# EAGLE schematic Schematic (EAGLE 9.7.0)
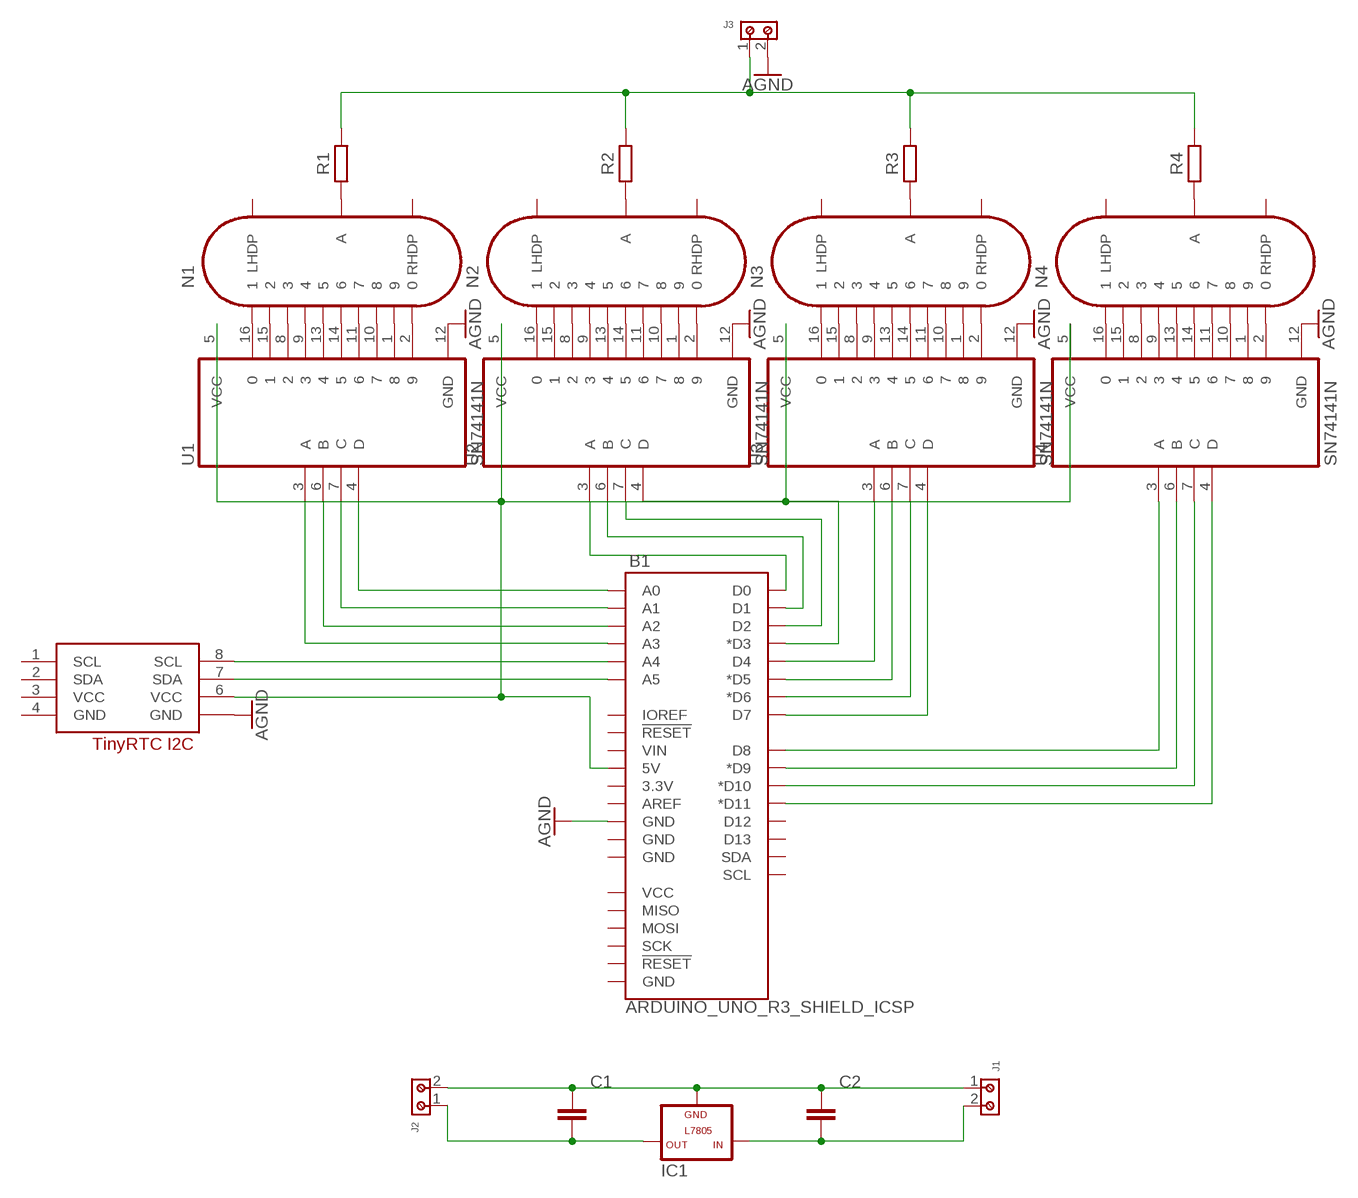
[diagram p0: schematic, sheet 1]

## Parts
B1  ARDUINO_UNO_R3_SHIELD_ICSP  [UNO_R3_SHIELD_ICSP]
C1  C_RADIAL-12.5MM-DIA  [CAPRD550W60D1025H1250B]
C2  C_RADIAL-12.5MM-DIA  [CAPRD550W60D1025H1250B]
IC1  L7805  [78XXL]
J1  691213710002  [691213710002]
J2  691213710002  [691213710002]
J3  691213710002  [691213710002]
N1  IN-14  [IN-14]
N2  IN-14  [IN-14]
N3  IN-14  [IN-14]
N4  IN-14  [IN-14]
R1  R_AXIAL-11.7MM-PITCH  [RESAD1176W63L850D250B]
R2  R_AXIAL-11.7MM-PITCH  [RESAD1176W63L850D250B]
R3  R_AXIAL-11.7MM-PITCH  [RESAD1176W63L850D250B]
R4  R_AXIAL-11.7MM-PITCH  [RESAD1176W63L850D250B]
T1  TINYRTC  [TINYRTC]
U1  SN74141N  [DIP762W46P254L2134H508Q16]
U2  SN74141N  [DIP762W46P254L2134H508Q16]
U3  SN74141N  [DIP762W46P254L2134H508Q16]
U4  SN74141N  [DIP762W46P254L2134H508Q16]

## Nets
AGND: B1.GND@2(GND) J3.2 T1.5(GND) U1.12(GND) U2.12(GND) U3.12(GND) U4.12(GND)
N$1: N1.1 U1.16
N$2: N1.2 U1.15
N$3: N1.3 U1.8
N$4: N1.4 U1.9
N$5: N1.5 U1.13
N$6: N1.6 U1.14
N$7: N1.7 U1.11
N$8: N1.8 U1.10
N$9: N1.9 U1.1
N$10: N1.0 U1.2
N$11: N2.1 U2.16
N$12: N2.2 U2.15
N$13: N2.3 U2.8
N$14: N2.4 U2.9
N$15: N2.5 U2.13
N$16: N2.6 U2.14
N$17: N2.7 U2.11
N$18: N2.8 U2.10
N$19: N2.9 U2.1
N$20: N2.0 U2.2
N$21: N3.1 U3.16
N$22: N3.2 U3.15
N$23: N3.3 U3.8
N$24: N3.4 U3.9
N$25: N3.5 U3.13
N$26: N3.6 U3.14
N$27: N3.7 U3.11
N$28: N3.8 U3.10
N$29: N3.9 U3.1
N$30: N3.0 U3.2
N$31: N4.1 U4.16
N$32: N4.2 U4.15
N$33: N4.3 U4.8
N$34: N4.4 U4.9
N$35: N4.5 U4.13
N$36: N4.6 U4.14
N$37: N4.7 U4.11
N$38: N4.8 U4.10
N$39: N4.9 U4.1
N$40: N4.0 U4.2
N$41: C1.1 C2.1 IC1.GND J1.1 J2.2
N$42: C2.2 IC1.IN J1.2
N$43: C1.2 IC1.OUT J2.1
N$44: B1.A5 T1.7(SDA)
N$45: B1.A4 T1.8(SCL)
N$46: B1.A0 U1.4(D)
N$47: B1.A1 U1.7(C)
N$48: B1.A2 U1.6(B)
N$49: B1.A3 U1.3(A)
N$50: B1.RX(D0) U2.3(A)
N$51: B1.TX(D1) U2.6(B)
N$52: B1.D2 U2.7(C)
N$53: B1.D3(*D3) U2.4(D)
N$54: B1.D4 U3.3(A)
N$55: B1.D5(*D5) U3.6(B)
N$56: B1.D6(*D6) U3.7(C)
N$57: B1.D7 U3.4(D)
N$58: B1.D9(*D9) U4.6(B)
N$59: J3.1 R1.2 R2.2 R3.2 R4.2
N$60: B1.D10(*D10) U4.7(C)
N$61: B1.D11(*D11) U4.4(D)
N$62: B1.D8 U4.3(A)
N$63: N1.A R1.1
N$64: N2.A R2.1
N$65: N3.A R3.1
N$66: N4.A R4.1
N$67: B1.5V T1.6(VCC) U1.5(VCC) U2.5(VCC) U3.5(VCC) U4.5(VCC)
Unconnected: B1.3.3V B1.5V_ICSP(VCC) B1.AREF B1.D12 B1.D13 B1.GND@0(GND) B1.GND@1(GND) B1.GND_ICSP(GND) B1.IOREF B1.MISO B1.MOSI B1.RES(!RESET!) B1.RST_ICSP(!RESET!) B1.SCK B1.SCL B1.SDA B1.VIN N1.LHDP N1.RHDP N2.LHDP N2.RHDP N3.LHDP N3.RHDP N4.LHDP N4.RHDP T1.1(SCL) T1.2(SDA)

## Power pins joined to a net without a drawn wire
GND: T1.4(GND)
VCC: T1.3(VCC)

## Library data of the parts
B1 = SparkFun-Boards:ARDUINO_UNO_R3_SHIELD_ICSP: Arduino R3 Shield Footprint with ICSP Header Includes pins for 6-pin (2x3) ICSP Header. Compatible with Leonardo boards that require SPI pin connections via this header. SparkFun Products: CryptoShield <https://www.sparkfun.com/products/13183> microSD Shield <https://www.sparkfun.com/products/12761> R3 Stackable Headers Kit <https://www.sparkfun.com/products/1417>
C1 C2 = Capacitor:C: Capacitor - Generic; CATEGORY: Capacitor
IC1 = tango:L7805: VOLTAGE REGULATOR
J1-J3 = Wurth_Connectors_WR-TBL Rising Cage Clamp:691213710002: WR-TBL Serie 213 - 5.00 mm Horiz.l Entry Modular KIND PROPERTIES Pitch 5 mm MATERIAL PROPERTIES Insulator Material PA66 Insulator Flammability Rating UL94 V-0 Insulator Color Green Contact Material Brass Contact Plating Copper over Zinc Terminal Screw Material Steel Terminal Screw Plating Zinc Wire Guard Material Brass GENERAL INFORMATION Operating Temperature -40 up to +105 °C Compliance Lead free / RoHS ELECTRICAL PROPERTIES IR UL 10 A IR VDE 10 A Working Voltage [UL] 300 V (AC) Working Voltage [VDE] 250 V (AC) Withstanding Voltage [UL] 1600 V (AC) Withstanding Voltage [cULus] 1600 V (AC) Withstanding Voltage [VDE] 2000 V (AC) Contact Resistance [UL] 20 mΩ Contact Resistance [cULus] 20 mΩ Contact Resistance [VDE] 20 mΩ MECHANICAL PROPERTIES Wire Strip Length 5 up to 6 (mm) Screw M2.5 CERTIFICATION UL Approval E315414 VDE Approval 40024437 VDE Approval 40024437 PACKAGING PROPERTIES Packaging Box <https://www.we-online.com/catalog/media/o33234v209%20Family_WR-TBL_69121371000x.jpg> Details see: https://www.we-online.com/catalog/en/TBL_5_00_213_HORIZONTAL_ENTRY_MODULAR_69121371000X/ Updated by Ella Wu 2019-11-22 2019(C) Wurth Elektronik; DATASHEET-URL: https://www.we-online.com/catalog/datasheet/691213710002.pdf; IR-UL: 10A; IR-VDE: 10A; MOUNT: THT; PART-NUMBER: 691213710002; PINS: 2; PITCH: 5mm; TYPE: Horizontal; WIRE: 26 to 16 (AWG) 0.129 to 1.31 (mm²); WORKING-VOLTAGE-UL: 300V (AC); WORKING-VOLTAGE-VDE: 250V (AC)
N1-N4 = russian-nixies:IN-14: IN-14: medium numeric frontview nixie tube
R1-R4 = Resistor:R: Resistor Fixed - Generic; CATEGORY: Resistor; SUB-CATEGORY: Fixed
T1 = RTC:TINYRTC
U1-U4 = SN74141N:SN74141N: BCD to DECIMAL Decoder/Driver; AVAILABILITY: Unavailable; MF: Texas Instruments; MP: SN74141N; PACKAGE: None; PRICE: None